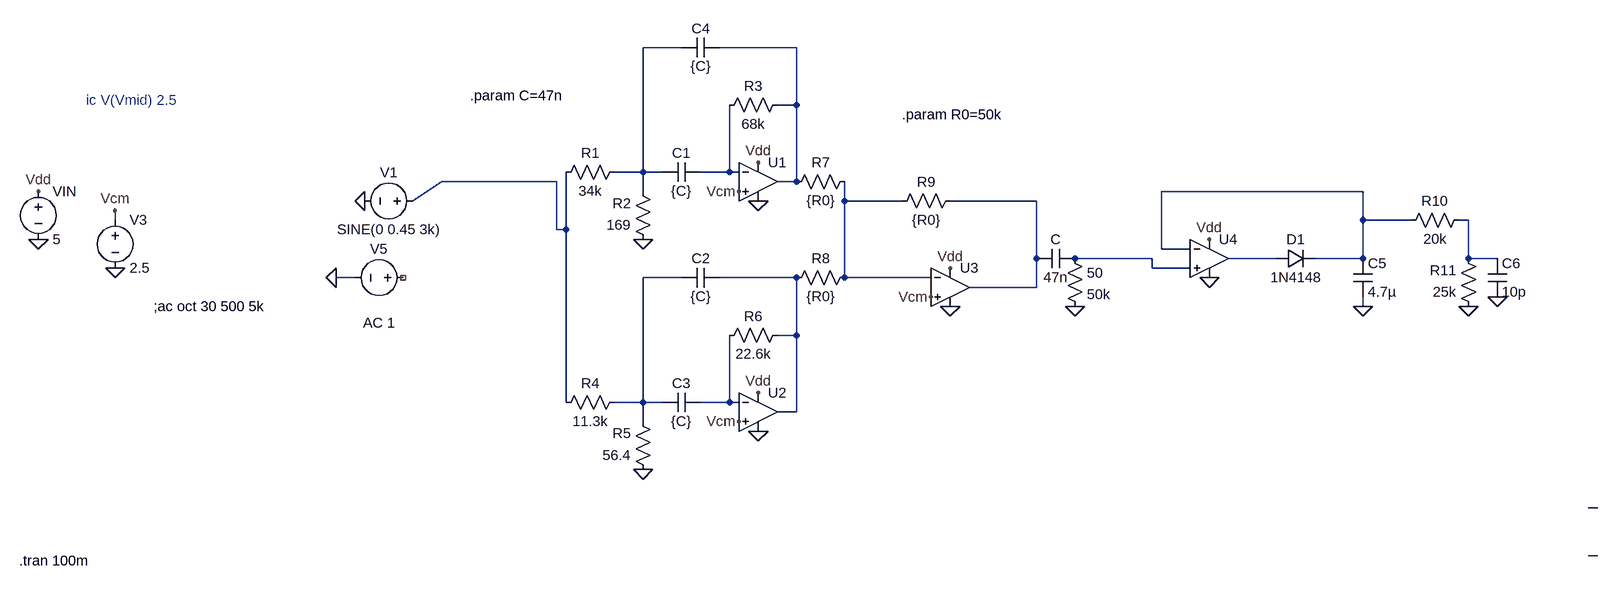
[diagram p0: schematic Adder and Peak Detector.asc]
Adder and Peak Detector.asc, the LTspice schematic file:
Version 4
SHEET 1 3780 2260
WIRE 288 -256 224 -256
WIRE 480 -256 352 -256
WIRE 480 -160 480 -256
WIRE 480 -160 448 -160
WIRE 224 -48 224 -256
WIRE 224 -48 176 -48
WIRE 256 -48 224 -48
WIRE 368 -48 368 -160
WIRE 368 -48 320 -48
WIRE 384 -48 368 -48
WIRE 80 -32 -112 -32
WIRE 480 -32 480 -160
WIRE 480 -32 448 -32
WIRE 224 -16 224 -48
WIRE 1424 -16 1088 -16
WIRE -160 0 -112 -32
WIRE 560 0 560 -32
WIRE 656 0 560 0
WIRE 880 0 736 0
WIRE -736 32 -736 16
WIRE 1424 32 1424 -16
WIRE 1504 32 1424 32
WIRE 1600 32 1584 32
WIRE 80 48 80 -32
WIRE 96 48 96 -48
WIRE 96 48 80 48
WIRE 1088 80 1088 -16
WIRE 1136 80 1088 80
WIRE 880 96 880 0
WIRE 1072 96 944 96
WIRE 1280 96 1200 96
WIRE 1424 96 1424 32
WIRE 1424 96 1344 96
WIRE 1600 96 1600 32
WIRE 1648 96 1600 96
WIRE 1072 112 1072 96
WIRE 1136 112 1072 112
WIRE -256 128 -288 128
WIRE 288 128 224 128
WIRE 480 128 352 128
WIRE 560 128 560 0
WIRE 704 128 560 128
WIRE 880 144 880 96
WIRE 880 144 768 144
WIRE 1424 176 1424 160
WIRE 480 224 480 128
WIRE 480 224 448 224
WIRE 96 336 96 48
WIRE 224 336 224 128
WIRE 224 336 176 336
WIRE 256 336 224 336
WIRE 368 336 368 224
WIRE 368 336 320 336
WIRE 384 336 368 336
WIRE 480 352 480 224
WIRE 480 352 448 352
WIRE 224 368 224 336
WIRE 3696 512 3680 512
WIRE 3696 592 3680 592
FLAG -864 64 0
FLAG -736 16 Vcm
FLAG -736 112 0
FLAG 224 64 0
FLAG 416 0 0
FLAG 384 -16 Vcm
FLAG -864 -16 Vdd
FLAG 416 -64 Vdd
FLAG 224 448 0
FLAG 416 384 0
FLAG 384 368 Vcm
FLAG 416 320 Vdd
FLAG -288 128 0
FLAG -240 0 0
FLAG 736 112 Vdd
FLAG 736 176 0
FLAG 704 160 Vcm
FLAG 944 176 0
FLAG 1168 64 Vdd
FLAG 1168 128 0
FLAG 1424 176 0
FLAG 1648 160 0
FLAG 1600 176 0
SYMBOL voltage -864 -32 R0
WINDOW 123 0 0 Left 0
WINDOW 39 0 0 Left 0
SYMATTR InstName VIN
SYMATTR Value 5
SYMBOL voltage -736 16 R0
WINDOW 123 0 0 Left 0
WINDOW 39 0 0 Left 0
SYMATTR InstName V3
SYMATTR Value 2.5
SYMBOL res 192 -64 R90
WINDOW 0 0 56 VBottom 2
WINDOW 3 32 56 VTop 2
SYMATTR InstName R1
SYMATTR Value 34k
SYMBOL res 240 80 R180
WINDOW 0 36 76 Left 2
WINDOW 3 36 40 Left 2
SYMATTR InstName R2
SYMATTR Value 169
SYMBOL res 352 -144 R270
WINDOW 0 32 56 VTop 2
WINDOW 3 0 56 VBottom 2
SYMATTR InstName R3
SYMATTR Value 68k
SYMBOL cap 352 -272 R90
WINDOW 0 0 32 VBottom 2
WINDOW 3 32 32 VTop 2
SYMATTR InstName C4
SYMATTR Value {C}
SYMBOL Opamps\\UniversalOpamp2 416 -32 R0
SYMATTR InstName U1
SYMBOL res 192 320 R90
WINDOW 0 0 56 VBottom 2
WINDOW 3 32 56 VTop 2
SYMATTR InstName R4
SYMATTR Value 11.3k
SYMBOL res 240 464 R180
WINDOW 0 36 76 Left 2
WINDOW 3 36 40 Left 2
SYMATTR InstName R5
SYMATTR Value 56.4
SYMBOL res 352 240 R270
WINDOW 0 32 56 VTop 2
WINDOW 3 0 56 VBottom 2
SYMATTR InstName R6
SYMATTR Value 22.6k
SYMBOL Opamps\\UniversalOpamp2 416 352 R0
SYMATTR InstName U2
SYMBOL voltage -160 128 R90
WINDOW 0 -32 56 VBottom 2
WINDOW 3 32 56 VTop 2
WINDOW 123 60 56 VTop 2
WINDOW 39 0 0 Left 0
SYMATTR InstName V5
SYMATTR Value ""
SYMATTR Value2 AC 1
SYMBOL cap 320 -64 R90
WINDOW 0 0 32 VBottom 2
WINDOW 3 32 32 VTop 2
SYMATTR InstName C1
SYMATTR Value {C}
SYMBOL cap 352 112 R90
WINDOW 0 0 32 VBottom 2
WINDOW 3 32 32 VTop 2
SYMATTR InstName C2
SYMATTR Value {C}
SYMBOL cap 320 320 R90
WINDOW 0 0 32 VBottom 2
WINDOW 3 32 32 VTop 2
SYMATTR InstName C3
SYMATTR Value {C}
SYMBOL voltage -144 0 R90
WINDOW 0 -32 56 VBottom 2
WINDOW 3 32 56 VTop 2
WINDOW 123 0 0 Left 0
WINDOW 39 0 0 Left 0
SYMATTR InstName V1
SYMATTR Value SINE(0 0.45 3k)
SYMBOL res 576 -48 R90
WINDOW 0 0 56 VBottom 2
WINDOW 3 32 56 VTop 2
SYMATTR InstName R7
SYMATTR Value {R0}
SYMBOL res 576 112 R90
WINDOW 0 0 56 VBottom 2
WINDOW 3 32 56 VTop 2
SYMATTR InstName R8
SYMATTR Value {R0}
SYMBOL res 752 -16 R90
WINDOW 0 0 56 VBottom 2
WINDOW 3 32 56 VTop 2
SYMATTR InstName R9
SYMATTR Value {R0}
SYMBOL Opamps\\UniversalOpamp2 736 144 R0
SYMATTR InstName U3
SYMBOL res 928 80 R0
SYMATTR InstName 50
SYMATTR Value 50k
SYMBOL cap 944 80 R90
WINDOW 0 0 32 VBottom 2
WINDOW 3 32 32 VTop 2
SYMATTR InstName C
SYMATTR Value 47n
SYMBOL diode 1280 112 R270
WINDOW 0 32 32 VTop 2
WINDOW 3 0 32 VBottom 2
SYMATTR InstName D1
SYMATTR Value 1N4148
SYMBOL Opamps\\UniversalOpamp2 1168 96 R0
SYMATTR InstName U4
SYMBOL cap 1408 96 R0
SYMATTR InstName C5
SYMATTR Value 4.7µ
SYMBOL res 1600 16 R90
WINDOW 0 0 56 VBottom 2
WINDOW 3 32 56 VTop 2
SYMATTR InstName R10
SYMATTR Value 20k
SYMBOL res 1616 192 R180
WINDOW 0 36 76 Left 2
WINDOW 3 36 40 Left 2
SYMATTR InstName R11
SYMATTR Value 25k
SYMBOL cap 1632 96 R0
SYMATTR InstName C6
SYMATTR Value 10p
TEXT -672 176 Left 2 !;ac oct 30 500 5k
TEXT -784 -168 Left 2 ;ic V(Vmid) 2.5
TEXT -64 -176 Left 2 !.param C=47n
TEXT -896 600 Left 2 !.tran 100m
TEXT 656 -144 Left 2 !.param R0=50k

The netlist it stands for:
* Adder and Peak Detector.asc
VIN Vdd 0 5
V3 Vcm 0 2.5
R1 N001 N004 34k
R2 0 N001 169
R3 N003 N002 68k
C4 N002 N001 {C}
XU1 Vcm N003 Vdd 0 N002 level.2 Avol=1Meg GBW=10Meg Slew=10Meg ilimit=25m rail=0 Vos=0 phimargin=45 en=0 enk=0 in=0 ink=0 Rin=500Meg  ; pins IN+ IN- V+ V- OUT
R4 N011 N004 11.3k
R5 0 N011 56.4
R6 N013 N012 22.6k
XU2 Vcm N013 Vdd 0 N012 level.2 Avol=1Meg GBW=10Meg Slew=10Meg ilimit=25m rail=0 Vos=0 phimargin=45 en=0 enk=0 in=0 ink=0 Rin=500Meg  ; pins IN+ IN- V+ V- OUT
V5 NC_01 0 AC 1
C1 N003 N001 {C}
C2 N012 N011 {C}
C3 N013 N011 {C}
V1 N004 0 SINE(0 0.45 3k)
R7 N006 N002 {R0}
R8 N006 N012 {R0}
R9 N007 N006 {R0}
XU3 Vcm N006 Vdd 0 N007 level.2 Avol=1Meg GBW=10Meg Slew=10Meg ilimit=25m rail=0 Vos=0 phimargin=45 en=0 enk=0 in=0 ink=0 Rin=500Meg  ; pins IN+ IN- V+ V- OUT
R§50 N009 0 50k
C N009 N007 47n
D1 N010 N005 1N4148
XU4 N009 N005 Vdd 0 N010 level.2 Avol=1Meg GBW=10Meg Slew=10Meg ilimit=25m rail=0 Vos=0 phimargin=45 en=0 enk=0 in=0 ink=0 Rin=500Meg  ; pins IN+ IN- V+ V- OUT
C5 N005 0 4.7µ
R10 N008 N005 20k
R11 0 N008 25k
C6 N008 0 10p
.model D D
.lib standard.dio
;ac oct 30 500 5k
* ic V(Vmid) 2.5
.param C=47n
.tran 100m
.param R0=50k
.lib UniversalOpamps2.sub
.backanno
.end